# EAGLE schematic MXP power (EAGLE 7.3.0)
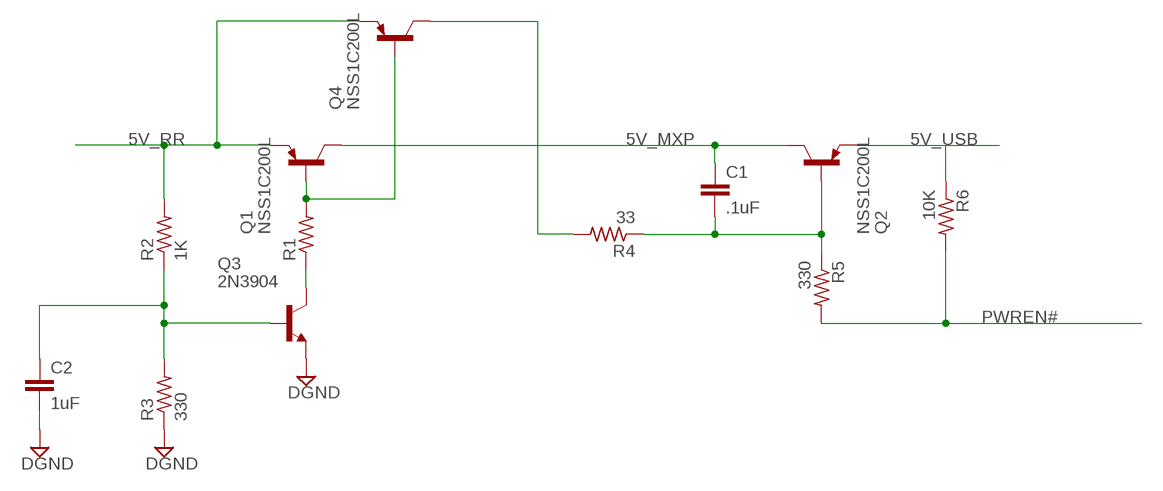
[diagram p0: schematic, sheet 1]

## Parts
C1  .1uF  C2,5-3  [C2.5-3]
C2  1uF  C2,5-3  [C2.5-3]
Q1  NSS1C200L  TIP30  [TO220]
Q2  NSS1C200L  TIP30  [TO220]
Q3  2N3904  [TO92]
Q4  NSS1C200L  TIP30  [TO220]
R1  R-US_R0603  [R0603]
R2  1K  R-US_R0603  [R0603]
R3  330  R-US_R0603  [R0603]
R4  33  R-US_R0603  [R0603]
R5  330  R-US_R0603  [R0603]
R6  10K  R-US_R0603  [R0603]

## Nets
5V_MXP: C1.1 Q1.2(C) Q2.2(C)
5V_RR: Q1.3(E) Q4.3(E) R2.2
5V_USB: Q2.3(E) R6.1
DGND: C2.2 Q3.3(E) R3.1
N$1: Q1.1(B) Q4.1(B) R1.2
N$2: Q4.2(C) R4.2
N$5: C2.1 Q3.2(B) R2.1 R3.2
N$6: Q3.1(C) R1.1
N$7: C1.2 Q2.1(B) R4.1 R5.1
PWREN#: R5.2 R6.2

## Library data of the parts
C1 C2 = capacitor-wima:C: CAPACITOR naming: grid - package width
Q1 Q2 Q4 = transistor-pnp:TIP30: PNP Transistor
Q3 = transistor-npn:2N3904: NPN Transistor
R1-R6 = resistor:R-US_: RESISTOR, American symbol